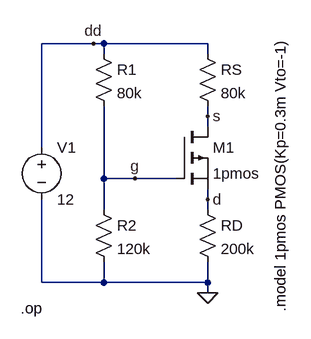
[diagram p0: schematic 13-3-4-a-1.asc]
13-3-4-a-1.asc, the LTspice schematic file:
Version 4
SHEET 1 880 680
WIRE 80 -32 0 -32
WIRE 96 -32 80 -32
WIRE 256 -32 96 -32
WIRE 96 -16 96 -32
WIRE 256 -16 256 -32
WIRE 256 80 256 64
WIRE 256 96 256 80
WIRE 0 128 0 -32
WIRE 96 176 96 64
WIRE 144 176 96 176
WIRE 208 176 144 176
WIRE 256 208 256 192
WIRE 96 224 96 176
WIRE 256 224 256 208
WIRE 0 336 0 208
WIRE 96 336 96 304
WIRE 96 336 0 336
WIRE 256 336 256 304
WIRE 256 336 96 336
WIRE 256 352 256 336
FLAG 256 352 0
FLAG 80 -32 dd
FLAG 144 176 g
FLAG 256 80 s
FLAG 256 208 d
SYMBOL res 80 -32 R0
SYMATTR InstName R1
SYMATTR Value 80k
SYMBOL res 80 208 R0
SYMATTR InstName R2
SYMATTR Value 120k
SYMBOL res 240 -32 R0
SYMATTR InstName RS
SYMATTR Value 80k
SYMBOL voltage 0 112 R0
WINDOW 123 0 0 Left 0
WINDOW 39 0 0 Left 0
SYMATTR InstName V1
SYMATTR Value 12
SYMBOL res 240 208 R0
SYMATTR InstName RD
SYMATTR Value 200k
SYMBOL pmos 208 96 R0
SYMATTR InstName M1
SYMATTR Value 1pmos
TEXT 368 -40 VRight 2 !.model 1pmos PMOS(Kp=0.3m Vto=-1)
TEXT -32 376 Left 2 !.op

The netlist it stands for:
* 13-3-4-a-1.asc
R1 dd g 80k
R2 g 0 120k
RS dd s 80k
V1 dd 0 12
RD d 0 200k
M1 s g d d 1pmos
.model NMOS NMOS
.model PMOS PMOS
.lib standard.mos
.model 1pmos PMOS(Kp=0.3m Vto=-1)
.op
.backanno
.end

* Results of the author's LTspice run, read from the files saved beside the schematic
* Operating Point:
*   V(dd) = 12 V
*   V(g) = 7.2 V
*   V(s) = 8.712 V
*   V(d) = 8.219 V
*   Id(M1) = 41.17 µA
*   Ig(M1) = 0 A
*   Ib(M1) = -1.875 µA
*   Is(M1) = -39.3 µA
*   I(Rd) = 41.1 µA
*   I(Rs) = 41.1 µA
*   I(R2) = 60 µA
*   I(R1) = 60 µA
*   I(V1) = -101.1 µA